# EAGLE board AIO (EAGLE 6.4)
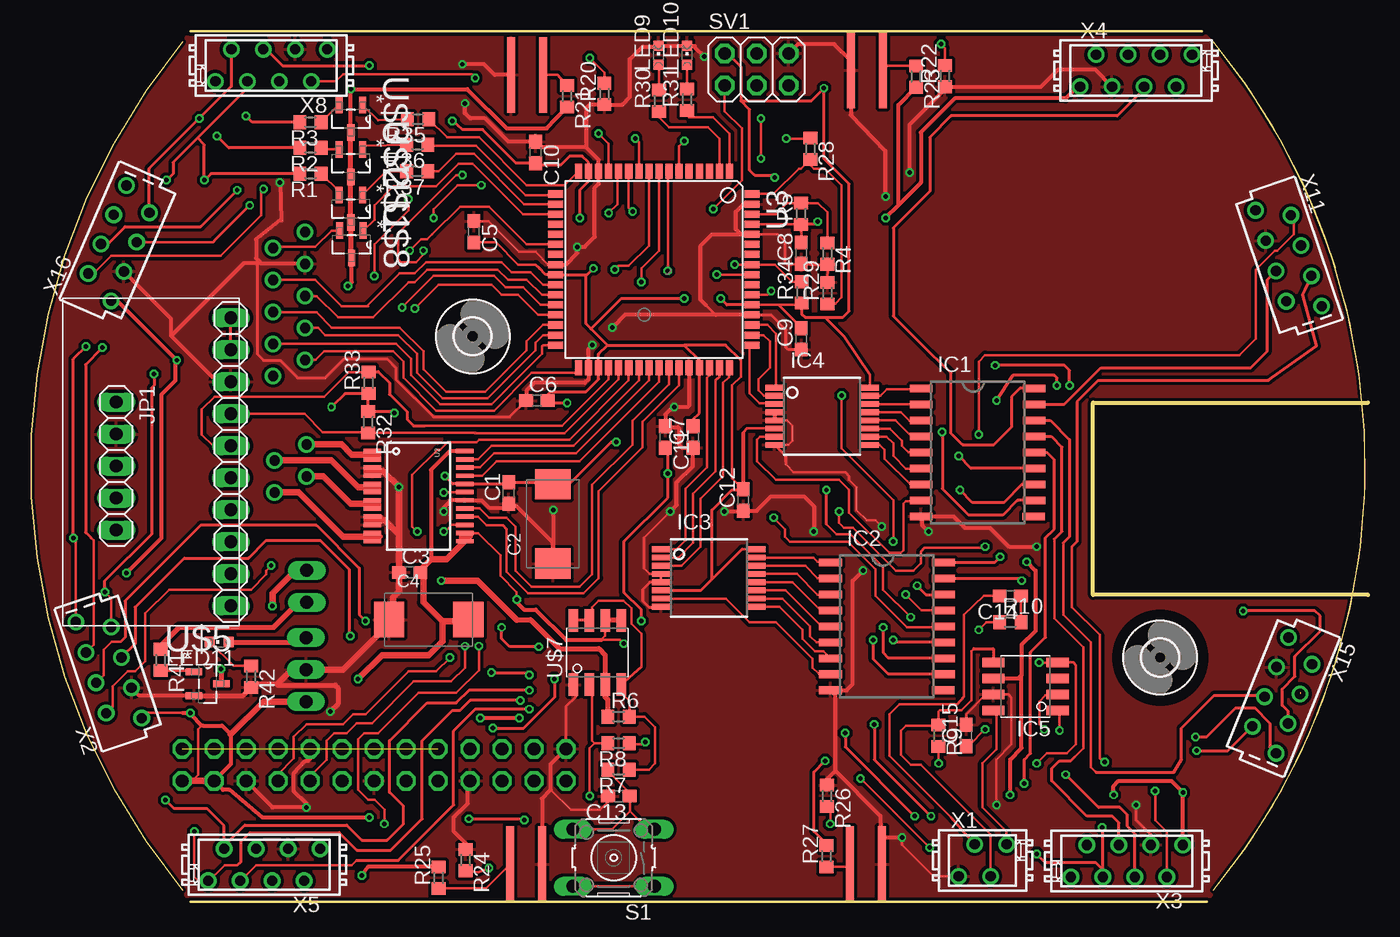
[diagram p2: board, top side]
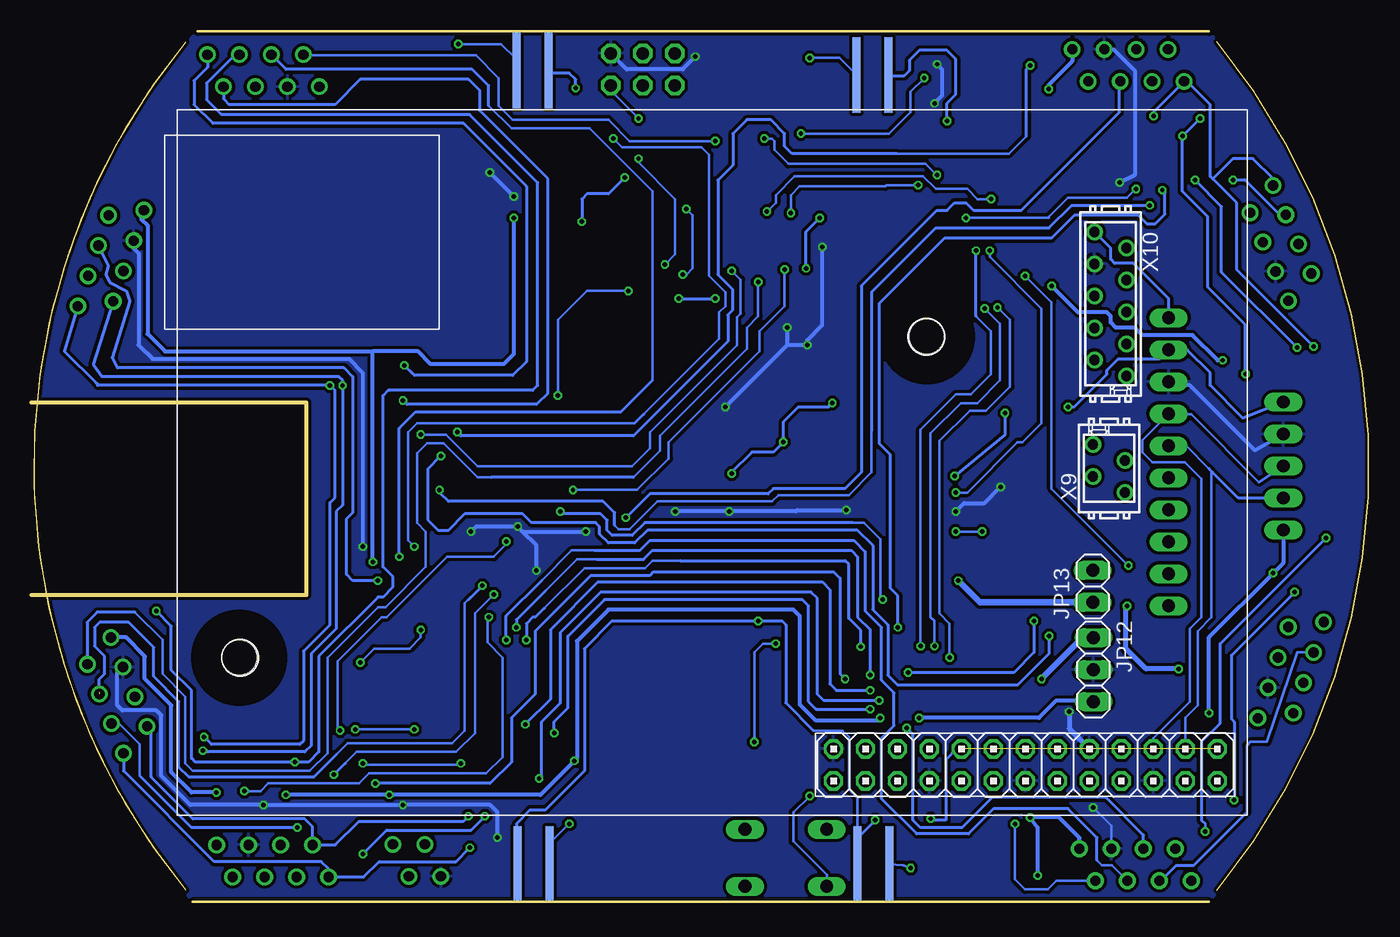
[diagram p3: board, bottom side, seen from below]

Size 106.14 x 69.1 mm. Coordinates in mm from the lower left corner, seen from the top.
Outline: 93.86,0.92 arc14 100.83,11.88
Outline: 100.83,11.88 arc43 103.56,50.33
Outline: 103.56,50.33 arc8 100.83,57.32
Outline: 100.83,57.32 arc14 93.86,68.28
Outline: 93.86,0.92 arc14 100.83,11.88
Outline: 100.83,11.88 arc43 103.56,50.33
Outline: 103.56,50.33 arc8 100.83,57.32
Outline: 100.83,57.32 arc14 93.86,68.28
Outline: 93.86,0.92 arc14 100.83,11.88
Outline: 100.83,11.88 arc43 103.56,50.33
Outline: 103.56,50.33 arc8 100.83,57.32
Outline: 100.83,57.32 arc14 93.86,68.28
Outline: 93.86,0.92 arc14 100.83,11.88
Outline: 100.83,11.88 arc43 103.56,50.33
Outline: 103.56,50.33 arc8 100.83,57.32
Outline: 100.83,57.32 arc14 93.86,68.28
Outline: 103.56,50.33 arc8 100.83,57.32
Outline: 93.86,0.92 arc22 103.56,18.87
Outline: 103.56,18.87 arc35 103.56,50.33
Outline: 103.56,50.33 arc8 100.83,57.32
Outline: 100.83,57.32 arc14 93.86,68.28
Outline: 93.86,0.92 arc22 103.56,18.87
Outline: 103.56,18.87 arc35 103.56,50.33
Outline: 103.56,50.33 arc8 100.83,57.32
Outline: 100.83,57.32 arc14 93.86,68.28
Outline: 12.02,68.28 arc79 12.02,0.92
Outline: 12.02,0.92 arc-79 12.02,68.28
Outline: 12.02,68.28 arc79 12.02,0.92
Outline: 12.02,0.92 arc-79 12.02,68.28
Outline: 12.02,68.28 arc79 12.02,0.92
Outline: 12.02,68.28 arc79 12.02,0.92
Outline: 12.02,0.92 arc-79 12.02,68.28
Outline: 12.02,68.28 arc79 12.02,0.92
Outline: 12.02,0.92 arc-79 12.02,68.28
Outline: 93.86,0.92 arc22 103.56,18.87
Outline: 103.56,18.87 arc35 103.56,50.33
Outline: 103.56,50.33 arc8 100.83,57.32
Outline: 100.83,57.32 arc14 93.86,68.28
Outline: 100.83,57.32 arc-8 103.56,50.33
Outline: 93.86,0.92 arc22 103.56,18.87
Outline: 103.56,18.87 arc35 103.56,50.33
Outline: 103.56,50.33 arc22 93.86,68.28
Outline: 93.86,0.92 arc22 103.56,18.87
Outline: 103.56,18.87 arc35 103.56,50.33
Outline: 103.56,50.33 arc22 93.86,68.28
Outline: 93.86,0.92 arc22 103.56,18.87
Outline: 103.56,18.87 arc35 103.56,50.33
Outline: 103.56,50.33 arc22 93.86,68.28
Outline: 93.86,0.92 arc22 103.56,18.87
Outline: 103.56,18.87 arc35 103.56,50.33
Outline: 103.56,50.33 arc22 93.86,68.28
Outline: 103.56,18.87 arc35 103.56,50.33
Outline: 103.56,50.33 arc22 93.86,68.28
Outline: 93.86,0.92 arc22 103.56,18.87
Outline: 103.56,18.87 arc57 93.86,68.28
Outline: 93.86,0.92 arc79 93.86,68.28
Outline: 12.63,69.1 92.93,69.1
Outline: 12.63,0 93.33,0
Outline: 106.14,39.63 84.3,39.63 84.3,24.37 106.14,24.37
Copper layers (1*2*15*16): Top 0.035mm / dielectric 0.2mm / layer 2 0.0175mm / dielectric 1.1mm / layer 15 0.0175mm / dielectric 0.2mm / Bottom 0.035mm
Design rules "DRC_critical": minimum track width 6mil, minimum drill 12mil, track to track 6mil, track to pad 6mil, pad to pad 6mil, via to via 6mil, smd to smd 0mil, copper to edge 10mil, drill to drill 10mil, minimum pad ring 10mil, minimum via ring 6mil, stop-mask expansion 2mil, vias tented up to drill 25mil, thermal gap 10mil

## Footprints (pad centres in the part's own frame; a part is rotated, then mirrored left to right if it is on the bottom)
C0603 = smd 1.1 x 1: 1 -0.85,0; 2 0.85,0
SMC_D = smd 2.4 x 2.8: + -3.15,0; - 3.15,0
SOP18 = smd 0.6 x 1.8: 1 -5.08,-4.475; 2 -3.81,-4.475; 3 -2.54,-4.475; 4 -1.27,-4.475; 5 0,-4.475; 6 1.27,-4.475; 7 2.54,-4.475; 8 3.81,-4.475; 9 5.08,-4.475; 10 5.08,4.475; 11 3.81,4.5; 12 2.54,4.5; 13 1.27,4.5; 14 0,4.5; 15 -1.27,4.5; 16 -2.54,4.5; 17 -3.81,4.5; 18 -5.08,4.5
SSOP16 = smd 0.46 x 1.43: 1 -2.275,-3.795; 2 -1.625,-3.795; 3 -0.975,-3.795; 4 -0.325,-3.795; 5 0.325,-3.795; 6 0.975,-3.795; 7 1.625,-3.795; 8 2.275,-3.795; 9 2.275,3.795; 10 1.625,3.795; 11 0.975,3.795; 12 0.325,3.795; 13 -0.325,3.795; 14 -0.975,3.795; 15 -1.625,3.795; 16 -2.275,3.795
SO08 = smd 0.72 x 1.78: 1 -1.905,-2.543; 2 -0.635,-2.543; 3 0.635,-2.543; 4 1.905,-2.543; 5 1.905,2.543; 6 0.635,2.543; 7 -0.635,2.543; 8 -1.905,2.543
1X05 = drill 1.016 long: 1 -5.08,0; 2 -2.54,0; 3 0,0; 4 2.54,0; 5 5.08,0
1X03 = drill 1.016 long: 1 -2.54,0; 2 0,0; 3 2.54,0
1X02 = drill 1.016 long: 1 -1.27,0; 2 1.27,0
CHIPLED_0603 = smd 0.8 x 0.8: A 0,-0.75; C 0,0.75
R0603 = smd 1 x 1.1: 1 -0.85,0; 2 0.85,0
B3F-10XX = drill 1.016 long: 1 -3.251,2.261; 2 3.251,2.261; 3 -3.251,-2.261; 4 3.251,-2.261
2X03 = drill 1.016 octagon: 1 -2.54,-1.27; 2 -2.54,1.27; 3 0,-1.27; 4 0,1.27; 5 2.54,-1.27; 6 2.54,1.27
SSOP24 = smd 0.348 x 1.397: 1 -3.575,-3.656; 2 -2.925,-3.656; 3 -2.275,-3.656; 4 -1.625,-3.656; 5 -0.975,-3.656; 6 -0.325,-3.656; 7 0.325,-3.656; 8 0.975,-3.656; 9 1.625,-3.656; 10 2.275,-3.656; 11 2.925,-3.656; 12 3.575,-3.656; 13 3.575,3.656; 14 2.925,3.656; 15 2.275,3.656; 16 1.625,3.656; 17 0.975,3.656; 18 0.325,3.656; 19 -0.325,3.656; 20 -0.975,3.656; 21 -1.625,3.656; 22 -2.275,3.656; 23 -2.925,3.656; 24 -3.575,3.656
TQFP-64A-64 = smd 1.194 x 0.559: 1 -7.8,6; 2 -7.8,5.2; 3 -7.8,4.4; 4 -7.8,3.6; 5 -7.8,2.8; 6 -7.8,2; 7 -7.8,1.2; 8 -7.8,0.4; 9 -7.8,-0.4; 10 -7.8,-1.2; 11 -7.8,-2; 12 -7.8,-2.8; 13 -7.8,-3.6; 14 -7.8,-4.4; 15 -7.8,-5.2; 16 -7.8,-6; 33 7.8,-6; 34 7.8,-5.2; 35 7.8,-4.4; 36 7.8,-3.6; 37 7.8,-2.8; 38 7.8,-2; 39 7.8,-1.2; 40 7.8,-0.4; 41 7.8,0.4; 42 7.8,1.2; 43 7.8,2; 44 7.8,2.8; 45 7.8,3.6; 46 7.8,4.4; 47 7.8,5.2; 48 7.8,6 | smd 0.559 x 1.194: 17 -6,-7.8; 18 -5.2,-7.8; 19 -4.4,-7.8; 20 -3.6,-7.8; 21 -2.8,-7.8; 22 -2,-7.8; 23 -1.2,-7.8; 24 -0.4,-7.8; 25 0.4,-7.8; 26 1.2,-7.8; 27 2,-7.8; 28 2.8,-7.8; 29 3.6,-7.8; 30 4.4,-7.8; 31 5.2,-7.8; 32 6,-7.8; 49 6,7.8; 50 5.2,7.8; 51 4.4,7.8; 52 3.6,7.8; 53 2.8,7.8; 54 2,7.8; 55 1.2,7.8; 56 0.4,7.8; 57 -0.4,7.8; 58 -1.2,7.8; 59 -2,7.8; 60 -2.8,7.8; 61 -3.6,7.8; 62 -4.4,7.8; 63 -5.2,7.8; 64 -6,7.8
SOT95P240X112-3N = smd 1.321 x 0.559: D 1.092,0; G -1.092,0.94; S -1.092,-0.94
2,8 = hole 2.8: 0,0
CNY70 = smd 6 x 0.635: LED_A -3,1.27; LED_C -3,-1.27 | smd 6 x 0.635 bottom: TRANS_C -3,-1.27; TRANS_E -3,1.27
GY-81 = drill 1.016 long: 3V3 8.89,-6.35; A_INT1 -3.81,-6.35; G_INT -6.35,-6.35; GND 6.35,-6.35; M_DRDY -1.27,-6.35; P_E0C -11.43,-6.35; P_XCLR -8.89,-6.35; SCL 3.81,-6.35; SDA 1.27,-6.35; VCC_IN 11.43,-6.35
RASPERRRY-PI = drill 1.016 octagon: 3V3@1 50.736,82.608; 3V3@2 50.736,62.288; 5V@1 53.276,82.608; 5V@2 53.276,80.068; GND@1 50.736,72.448; GND@2 50.736,52.128; GND@3 53.276,77.528; GND@4 53.276,67.368; GND@5 53.276,59.748; GPIO_0 50.736,80.068; GPIO_1 50.736,77.528; GPIO_4 50.736,74.988; GPIO_7 53.276,52.128; GPIO_8 53.276,54.668; GPIO_9 50.736,57.208; GPIO_10 50.736,59.748; GPIO_11 50.736,54.668; GPIO_14 53.276,74.988; GPIO_15 53.276,72.448; GPIO_17 50.736,69.908; GPIO_18 53.276,69.908; GPIO_21 50.736,67.368; GPIO_22 50.736,64.828; GPIO_23 53.276,64.828; GPIO_24 53.276,62.288; GPIO_25 53.276,57.208
MICROMATCH-4 = drill 0.813: 1 1.905,1.27; 2 0.635,-1.27; 3 -0.635,1.27; 4 -1.905,-1.27
FSIDE-8 = drill 0.813: 1 -4.445,-1.27; 2 -3.175,1.27; 3 -1.905,-1.27; 4 -0.635,1.27; 5 0.635,-1.27; 6 1.905,1.27; 7 3.175,-1.27; 8 4.445,1.27
MICROMATCH-8 = drill 0.813: 1 4.445,1.27; 2 3.175,-1.27; 3 1.905,1.27; 4 0.635,-1.27; 5 -0.635,1.27; 6 -1.905,-1.27; 7 -3.175,1.27; 8 -4.445,-1.27
MICROMATCH-10 = drill 0.813: 1 5.715,1.27; 2 4.445,-1.27; 3 3.175,1.27; 4 1.905,-1.27; 5 0.635,1.27; 6 -0.635,-1.27; 7 -1.905,1.27; 8 -3.175,-1.27; 9 -4.445,1.27; 10 -5.715,-1.27

## Placement (x,y rotation side)
C1  100nF  [C0603]  37.89,32.46 90 top
C2  10uF  [SMC_D]  41.4,30.01 90 top
C3  100nF  [C0603]  30.03,26.16 0 top
C4  10uF  [SMC_D]  31.54,22.41 0 top
C5  100nF  [C0603]  35.13,53.2 270 top
C6  100nF  [C0603]  40.13,39.8 0 top
C7  100nF  [C0603]  52.53,36.9 90 top
C8  100nF  [C0603]  61.13,51.5 90 top
C9  100nF  [C0603]  61.13,44.7 90 top
C10  100nF  [C0603]  40.03,59.5 270 top
C11  100nF  [C0603]  50.33,36.9 270 top
C12  100nF  [C0603]  56.53,31.9 90 top
C13  1uF  [C0603]  46.63,8.4 180 top
C14  100nF  [C0603]  77.73,24.3 180 top
C15  1uF  [C0603]  74.23,13.2 90 top
IC1  ULN2803ASOP18  [SOP18]  75.12,35.68 270 top
IC2  ULN2803ASOP18  [SOP18]  67.92,21.88 270 top
IC3  74HC238SSOP  [SSOP16]  53.79,25.71 270 top
IC4  74HC238SSOP  [SSOP16]  62.79,38.55 270 top
IC5  TS34119SMD  [SO08]  78.93,17.1 90 top
JP1  [1X05]  6.73,34.6 270 top
JP12  Step_Down_Conn  [1X03]  21.8,18.43 270 bottom
JP13  batt_conn  [1X02]  21.86,25.05 90 bottom
LED9  [CHIPLED_0603]  49.79,67.21 0 top
LED10  [CHIPLED_0603]  52.06,67.21 0 top
LED11  [CHIPLED_0603]  14.91,20.63 90 top
R1  [R0603]  22.15,57.82 180 top
R2  [R0603]  22.15,59.86 180 top
R3  [R0603]  22.15,61.9 180 top
R4  10K  [R0603]  63.2,51.47 270 top
R5  10K  [R0603]  61.12,54.63 90 top
R6  10k  [R0603]  46.63,14.7 0 top
R7  100k  [R0603]  46.63,10.5 180 top
R8  10k  [R0603]  46.63,12.6 180 top
R9  75k  [R0603]  72.03,13.2 270 top
R10  3k  [R0603]  77.73,22.2 0 top
R20  [R0603]  45.49,64.14 90 top
R21  [R0603]  42.53,63.96 270 top
R22  [R0603]  72.55,65.56 90 top
R23  [R0603]  70.25,65.52 270 top
R24  [R0603]  34.48,3.32 270 top
R25  [R0603]  32.34,1.92 90 top
R26  [R0603]  63.18,8.42 270 top
R27  [R0603]  63.14,3.62 90 top
R28  [R0603]  61.85,59.78 270 top
R29  [R0603]  63.21,48.33 90 top
R30  [R0603]  49.82,63.59 90 top
R31  [R0603]  52.06,63.69 90 top
R32  [R0603]  26.74,38.09 270 top
R33  [R0603]  26.76,41.21 90 top
R34  10K  [R0603]  61.16,48.38 90 top
R35  100R  [R0603]  30.7,62.14 180 top
R36  100R  [R0603]  30.64,60.12 180 top
R37  100R  [R0603]  30.64,58.01 180 top
R41  100R  [R0603]  10.26,19.21 270 top
R42  [R0603]  17.44,17.88 270 top
S1  [B3F-10XX]  46.23,3.5 180 top
SV1  PDI  [2X03]  57.59,66.09 0 top
U2  TB6612FNG  [SSOP24]  30.74,32.21 270 top
U3  ATXMEGA64D3-AU  [TQFP-64A-64]  49.43,50.2 270 top
U$1  DMN2075U  [SOT95P240X112-3N]  25.36,55.04 270 top
U$2  DMN2075U  [SOT95P240X112-3N]  25.36,58.65 270 top
U$3  DMN2075U  [SOT95P240X112-3N]  25.36,62.16 270 top
U$4  [2,8]  89.63,19.4 0 top
U$5  DMN2075U  [SOT95P240X112-3N]  13.99,17.32 0 top
U$6  [2,8]  35.03,44.9 0 top
U$7  DMC3028LSD  [SO08]  44.93,19.8 0 top
U$8  DMN2075U  [SOT95P240X112-3N]  25.41,52.2 270 top
U$21  CNY70  [CNY70]  39.36,62.65 270 top
U$22  CNY70  [CNY70]  66.33,63.02 270 top
U$23  CNY70  [CNY70]  39.29,5.99 90 top
U$24  CNY70  [CNY70]  66.26,5.99 90 top
U$25  GY-81  [GY-81]  9.48,34.94 90 top
U$26  RASPBERRY-PI  [RASPERRRY-PI]  94.57,62.88 270 bottom
X1  MICROMATCH-4  [MICROMATCH-4]  75.53,3.3 0 top
X2  [FSIDE-8]  6.13,18.4 108.5 top
X3  MICROMATCH-8  [MICROMATCH-8]  86.99,3.25 180 top
X4  MICROMATCH-8  [MICROMATCH-8]  87.72,65.99 0 top
X5  MICROMATCH-8  [MICROMATCH-8]  18.47,2.95 180 top
X8  MICROMATCH-8  [MICROMATCH-8]  19.04,66.41 180 top
X9  MICROMATCH-4  [MICROMATCH-4]  20.57,34.41 90 bottom
X10  MICROMATCH-10  [MICROMATCH-10]  20.45,47.47 270 bottom
X11  [FSIDE-8]  99.83,51.1 288.7 top
X15  [FSIDE-8]  99.33,16.4 247.9 top
X16  [FSIDE-8]  6.93,52.3 66.5 top

## Tracks (layer width: path | path; a pad name or v marks a point on that pad's centre or on a via)
+3V3  (via drill 0.36)  (1 unrouted)
  Top 0.203: C8.2 61.13,53.2 61.13,53.5 60.83,53.8 U3.61 | C5.2 36.88,52.35 38.63,50.6 40.03,50.6 40.33,50.3 | 56.43,28 IC3.16 | 56.33,43 56.33,41.7 55.63,41 55.63,33.65 C12.2 | U3.53 59.33,47.4 61.17,47.4 R34.1 | IC4.16 66.59,41.84 64.53,44.9 | 56.53,37.2 56.53,37.3 56.83,37.6 58.97,37.6 IC4.6
  Top 0.229: v34.73,6.6 39.03,6.6 v39.13,6.5 | U$25.3V3 U$25.VCC_IN | 37.83,33.2 37.83,33.25 C1.2 41.25,33.31 C2.- 42.69,33.16 46.03,36.5 v46.43,36.5 | v23.83,39.3 24.89,40.36 R33.1 26.74,40.34 R32.1 28.69,38.94 v28.83,38.8 | v32.83,33.8 33.45,33.18 U2.20 37.77,33.18 | 40.33,50.3 40.83,49.8 U3.25 44.13,49.8 | 50.33,35.7 C11.2 50.53,35.85 v50.53,34 50.53,32.1 47.03,28.6 47.03,24.6 48.43,23.2 v48.43,22.3 | 45.73,44.2 45.03,43.5 U3.35 45.03,41.5 44.03,40.5 41.23,40.5 40.98,40.25 C6.2 | 45.73,44.2 51.83,44.2 | 51.83,44.2 53.03,43 U3.45 53.03,38.8 52.53,38.3 C7.2 | v33.43,62 34.23,61.3 35.83,61.3 38.48,58.65 C10.2 40.18,58.5 42.03,58.5 42.73,59.2 43.73,59.2 44.23,58.7 U3.15 44.23,57.2 43.53,56.5 v43.53,54.3 | SV1.2 55.05,67.58 56.33,66.3 56.33,63.6 | 41.08,39.9 C6.2 | 51.83,44.2 55.13,44.2 56.33,43 | 44.43,45.5 45.73,44.2 | U3.53 55.23,47.4 v54.73,47.9 | v51.83,47.9 46.83,47.9 44.43,45.5 | 44.13,49.8 v44.63,50.3 | 44.43,45.5 44.03,45.9 44.03,49.7 44.13,49.8 | C12.2 56.48,32.7 55.63,32.7 54.03,31.1 54.03,25.6 | 54.03,25.6 56.43,28 | IC3.6 53.17,24.73 54.03,25.6 | 56.33,63.6 57.03,62.9 57.03,58.1 57.43,57.7 58.83,57.7 v59.03,57.5 | v62.43,54 62.23,53.8 61.14,53.8 R5.1 61.12,53.21 61.13,53.2 | 56.33,63.6 61.93,63.6 v62.93,64.6 62.93,59 64.93,57 64.93,46.9 64.43,46.4 63.03,46.4 | R34.1 61.16,46.67 61.43,46.4 63.03,46.4 | C9.2 61.38,45.35 59.33,47.4 | 64.53,44.9 63.03,46.4 | v42.53,39.6 41.18,39.6 C6.2
  Top 0.305: 32.95,33.68 v32.83,33.8 | 37.77,33.18 C1.2 | 41.36,33.2 C2.- | C12.2 56.53,37.2
  Bottom 0.203: U$23.TRANS_C 40.56,8.23 41.23,8.9 41.23,13.1 41.73,13.6 44.03,13.6
  Bottom 0.229: U$23.TRANS_C 40.56,5.07 v39.13,6.5 | U$26.3V3@2 32.69,12.14 33.53,11.3 33.53,6.5 34.63,6.5 v34.73,6.6 | U$24.TRANS_C 67.63,3.39 67.63,6.2 66.53,7.3 65.33,7.3 62.23,10.4 62.23,20.1 60.03,22.3 v48.43,22.3 46.53,22.3 46.23,22 46.23,15.8 44.03,13.6 | U$25.VCC_IN 15.83,47.9 18.63,50.7 20.13,50.7 20.43,51 20.43,51.89 X10.10 | v23.83,39.3 23.33,39.3 20.73,41.9 20.73,42.2 19.83,43.1 16.56,43.1 U$25.3V3 15.8,43.8 14.33,43.8 12.53,42 12.53,41 9.94,38.41 JP1.1 | v28.83,38.8 28.83,37.1 v32.83,33.8 | 38.09,64.16 U$21.TRANS_C 38.04,65.6 36.83,65.6 36.43,66 36.43,66.8 35.63,67.6 33.43,67.6 32.73,66.9 32.73,64.1 33.43,63.4 v33.43,62 | v54.73,47.9 v51.83,47.9 | v62.93,64.6 62.93,65.3 63.43,65.8 64.84,65.8 U$22.TRANS_C | v44.63,50.3 44.63,53.2 v43.53,54.3 | v50.53,34 50.53,34.1 48.93,35.7 47.23,35.7 v46.43,36.5 46.43,38.1 45.23,39.3 42.83,39.3 v42.53,39.6 | v59.03,57.5 60.33,56.2 62.03,56.2 62.43,55.8 v62.43,54
+5V  (via drill 0.36)
  Top 0.203: R27.2 62.96,4.47 | 12.03,15 9.16,15 X2.1 | 13.63,14 13.53,14 13.23,13.7 13.23,10.1 12.73,9.6
  Top 0.229: 62.96,4.47 62.96,4.77 62.13,5.6 62.13,10.3 v63.03,11.2
  Top 0.305: U$3.D v25.36,64.53 34.6,64.53 37.73,61.4 40.92,61.4 R21.2 | R25.2 26.7,2.77 v26.23,2.1 | v25.13,48.9 25.43,49.2 25.43,51.09 U$8.D | X4.8 83.05,64.72 82.13,63.8 73.33,63.8 70.63,61.1 70.63,57.1 68.83,55.3 | 70.23,64.65 R23.2 68.83,63.25 68.83,55.3 | v79.03,27 79.73,26.3 79.73,21.5 78.63,20.4 78.63,18 | v26.83,6.7 18.33,6.7 15.73,8.9 15.21,8.9 U$26.5V@2 15.83,10.93 15.83,13.3 15.13,14 13.63,14 | v67.83,54.3 68.83,55.3 | v7.53,26.1 10.33,28.9 10.33,40.3 11.43,41.4 11.43,42.9 v11.53,43 6.82,47.72 X16.1 | X3.8 v91.44,8.7 90.53,9.6 86.33,9.6 85.93,9.2 v85.93,8.5 | v35.63,14.6 v38.73,14.6 | IC5.6 78.37,17.73 78.63,18 | v77.73,8.5 77.73,11.3 78.63,12.2 78.63,18 | 12.03,15 v12.63,15 12.63,14.9 13.53,14
  Top 0.406: U$3.D U$2.D U$1.D 25.36,51.16 U$8.D
  Top 0.508: U$26.5V@2 U$26.5V@1 | JP12.3 18.42,15.89 15.83,13.3
  Bottom 0.305: X8.8 23.49,66.74 25.36,64.87 v25.36,64.53 | v12.63,15 12.63,21 v7.53,26.1 6.73,26.9 JP1.5 | X5.8 22.92,5.08 24.53,6.7 v26.83,6.7 26.23,5.9 v26.23,2.1 | v11.53,43 11.93,43 13.93,45 17.93,45 18.53,45.6 20.03,45.6 20.43,46 20.43,46.5 20.73,46.8 23.03,46.8 v25.13,48.9 | 79.03,43.7 95.53,43.7 96.93,45.1 96.93,53.7 97.42,54.19 97.21,54.41 X11.1 | v79.03,27 79.03,43.7 | v67.83,54.3 67.83,43.5 68.63,42.7 74.43,42.7 75.43,43.7 79.03,43.7 | v85.93,8.5 v77.73,8.5 65.73,8.5 v63.03,11.2 62.83,11.4 62.83,20.7 60.33,23.2 45.63,23.2 45.13,22.7 45.13,15.7 43.83,14.4 38.93,14.4 v38.73,14.6 | v91.44,8.7 93.43,8.7 95.03,10.3 95.03,15.6 97.13,17.7 97.13,19.5 98.63,21 X15.1 | JP12.3 21.91,16 24.73,16 26.13,14.6 v35.63,14.6
+7V  (via drill 0.36)
  Top 0.203: U2.14 35.45,29.29 37.23,27.5 37.23,25.9 38.53,24.6 v38.53,24 | 62.2,60.63 R28.1 61.82,60.6 v59.93,60.6 | v64.13,31 64.13,30.1 64.53,29.7 65.23,29.7 68.63,26.3 70.03,26.3 70.63,26.9 70.63,27.8 70.93,28.1 75.63,28.1 v75.73,28.2 | U$7.6 45.57,21.14 45.23,20.8 46.73,20.8 v47.03,20.5 | v48.73,12.7 48.53,12.5 47.58,12.5 R8.1
  Top 0.305: U2.24 33.22,35.78 31.73,34.3 31.73,27.2 | 34.13,28.8 34.13,29.02 U2.14 | v38.53,24 38.53,23.8 39.13,23.2 40.03,23.2 42.43,20.8 45.23,20.8
  Top 0.406: U2.13 34.47,28.64 34.83,29 34.33,29 34.13,28.8 | LED11.A 21.46,20.63 JP12.1 | U$7.5 U$7.6
  Top 0.508: 32.63,22.27 32.63,20.7 31.53,19.6 27.83,19.6 v25.93,17.7 | U2.13 32.97,27.2 31.73,27.2 31.08,26.55 C3.2 31.13,26.11 31.13,23.77 32.63,22.27 | 32.63,22.27 34.55,22.27 C4.- 35.23,22.4 35.23,21.9
  Bottom 0.203: v75.73,28.2 76.23,28.7 76.23,37.3 75.53,38 58.23,38 | v38.53,24 38.73,24.2 38.73,28.8 40.03,30.1 40.93,30.1 | 57.53,38.7 51.53,44.7 51.53,46.8 51.03,47.3 51.03,48.4 52.33,49.7 52.33,59.3 52.93,59.9 59.23,59.9 v59.93,60.6 | v47.03,20.5 48.03,20.5 48.73,19.8 v48.73,12.7
  Bottom 0.229: 40.93,30.1 57.43,30.1 58.43,29.1 60.03,29.1 60.43,29.5 60.43,30.3 60.93,30.8 63.93,30.8 v64.13,31 | 57.53,38.7 58.23,38
  Bottom 0.508: v25.93,17.7 22.6,21.03 21.86,21.03 JP12.1
ADISTANCE_0  (via drill 0.36)
  Top 0.203: U3.6 51.43,60 v51.83,60.4
  Bottom 0.203: X4.7 84.49,67.2 70.83,67.2 69.03,65.4 69.03,63.2 67.93,62.1 60.33,62.1 58.63,60.4 v51.83,60.4
ADISTANCE_1  (via drill 0.36)
  Top 0.203: U3.7 50.53,57.9 v50.53,50.1 | X11.2 100.02,54.63 100.23,54.85 100.23,53 98.93,51.7 98.73,51.7 97.23,50.2 97.23,44.7 95.93,43.4 75.73,43.4 75.23,42.9 v75.23,37.1
  Bottom 0.203: v50.53,50.1 49.83,49.4 49.83,46.7 50.13,46.4 50.13,44.2 57.03,37.3 57.03,36 58.43,34.6 70.73,34.6 73.23,37.1 v75.23,37.1
ADISTANCE_2  (via drill 0.36)
  Top 0.203: U3.8 49.83,51.7 48.43,50.3 v48.43,49.2
  Bottom 0.203: v48.43,49.2 48.43,46.5 49.33,45.6 49.33,43.9 56.23,37 56.23,35.8 58.33,33.7 | 69.63,33.7 70.73,33.7 73.43,36.4 74.73,36.4 75.53,35.6 75.53,30.1 74.83,29.4 74.83,26.6 78.03,23.4 78.63,23.4 82.63,19.4 82.63,11.8 84.03,10.4 93.33,10.4 93.93,11 93.93,16.3 95.73,18.1 95.73,20.8 97.93,23
  Bottom 0.229: 58.33,33.7 69.63,33.7 | 97.93,23 100.93,23 101.73,22.2 101.73,18.89 X15.2
ADISTANCE_3  (via drill 0.36)
  Top 0.203: X3.7 90.17,5.57 89.23,6.5 v89.23,8.8 | U3.9 49.03,52.1 47.43,50.5 46.63,50.5 v46.33,50.2 | 63.13,30 63.93,29.2 65.03,29.2 67.63,26.6 67.63,24.8 v69.83,22.6
  Top 0.229: 63.13,30 v63.13,32.7
  Bottom 0.203: v46.33,50.2 46.33,47.3 48.33,45.3 48.33,43.7 55.53,36.5 55.53,35.2 58.03,32.7 v63.13,32.7 | v89.23,8.8 87.93,8.8 87.33,9.4 80.13,9.4 79.33,10.2 70.03,10.2 68.73,11.5 68.73,19.4 69.93,20.6 69.93,22.5 v69.83,22.6
ADISTANCE_4  (via drill 0.36)
  Top 0.203: v28.03,6.2 28.03,7.3 27.23,8.1 26.73,8.1 25.93,8.9 25.93,12.9 26.43,13.4 27.53,13.4 30.73,16.6 33.73,16.6 35.53,18.4 v35.53,20.3 | U3.10 48.23,60.3 v47.93,60.6 | v34.23,57.7 33.73,57.7 29.13,53.1 29.13,51 29.33,50.8 30.53,50.8 31.13,51.4 v31.13,51.7
  Bottom 0.203: v35.53,20.3 35.53,37.5 32.73,40.3 31.53,40.3 29.93,41.9 29.93,45.3 31.13,46.5 | v47.93,60.6 47.33,60.6 47.13,60.4 47.13,59.7 46.03,58.6 35.13,58.6 v34.23,57.7 | X5.7 24.75,1.68 25.43,1 27.23,1 28.03,1.8 v28.03,6.2
  Bottom 0.229: 31.13,46.5 v31.13,51.7
ADISTANCE_5  (via drill 0.36)
  Top 0.203: v27.23,49.7 27.23,52.2 29.93,54.9 v29.93,55.8 | v19.03,26.7 18.63,26.3 18.63,26 17.43,24.8 10.93,24.8 9.03,22.9 9.03,19.1 8.23,18.3 7.63,18.3 6.43,17.1 6.43,15.48 X2.2 | U3.11 47.43,55.1 v47.73,54.8
  Bottom 0.203: v19.03,26.7 25.13,32.8 25.13,47.6 v27.23,49.7 | v29.93,55.8 31.03,55.8 31.83,56.6 34.33,56.6 35.33,57.6 45.53,57.6 47.03,56.1 47.03,55.5 v47.73,54.8
ADISTANCE_6  (via drill 0.36)
  Top 0.203: U3.12 46.53,58.1 46.53,55.4 v45.83,54.7 | v18.43,56.6 18.23,56.4 18.23,54.5 15.03,51.3 6.33,51.3 4.93,49.89 X16.2 | v35.73,56.9 33.83,56.9 31.93,55 v31.93,54.3
  Bottom 0.203: v31.93,54.3 25.33,54.3 25.33,54.4 23.83,55.9 19.13,55.9 v18.43,56.6 | v45.83,54.7 45.83,56.1 45.13,56.8 38.33,56.8 38.23,56.9 v35.73,56.9
ADISTANCE_7  (via drill 0.36)
  Top 0.203: X8.7 24.17,65.14 24.73,65.7 34.93,65.7 v35.23,65.4 | U3.13 45.83,60.2 v45.03,61
  Bottom 0.203: v35.23,65.4 36.33,64.3 36.33,62.7 38.03,61 v45.03,61
AUDIO_DISABLE  (via drill 0.36)
  Top 0.203: U3.54 58.43,48.2 v58.73,48.5 | v64.33,40.2 64.33,36 68.43,31.9 v68.43,28.6 | v81.63,13.6 81.63,15.04 IC5.1
  Bottom 0.203: v58.73,48.5 62.03,48.5 64.33,46.2 v64.33,40.2 | v68.43,28.6 68.43,28.4 69.43,27.4 73.13,27.4 77.93,22.6 78.33,22.6 81.83,19.1 81.83,13.8 v81.63,13.6
AUDIO_IN
  Top 0.203: C14.2 75.63,24.3 74.03,22.8 74.03,16.3 73.53,15.7 68.93,15.7 68.13,14.9 68.13,11.6 73,6.74 X1.3
BATT_GND  (via drill 0.36)
  Top 0.406: U$5.D 15.09,18.45 v15.03,18.5
  Top 0.508: v19.13,23.5 19.13,24.5 20.93,26.3 21.84,26.3 JP13.2
  Bottom 0.406: v15.03,18.5 17.63,18.5 19.23,20.1 19.23,23.4 v19.13,23.5
BATT_U  (via drill 0.36)
  Top 0.406: R41.1 10.26,20.33 11.73,21.8 19.23,21.8 21.23,23.8 21.84,23.8 JP13.1 | 38.53,22.4 39.63,22.4 41.93,20.1 45.07,20.1 45.57,19.6 U$7.3 45.53,17.22 45.53,16.3 45.78,16.05 R6.1
  Top 0.508: v32.53,25.5 35.43,25.5 38.53,22.4
  Bottom 0.508: JP13.1 30.81,23.78 v32.53,25.5
BATT_VOLTAGE
  Top 0.203: U3.64 58.93,56.2 60.93,58.2 61.12,58.2 R28.2 61.85,58.48 62.13,58.2 63.03,58.2 64.33,56.9 64.33,48 63.83,47.5 63.23,47.5 R29.1
BATT_WARN_0
  Top 0.203: R31.1 52.06,62.47 52.23,62.3 54.13,62.3 55.43,61 U3.1
BATT_WARN_1
  Top 0.203: R30.1 49.82,62.31 50.63,61.5 53.73,61.5 54.63,60.6 U3.2
COLOR_DIODE_1
  Top 0.203: X10.4 22.77,45.56 23.33,45 29.13,45 30.63,43.5 30.63,42 32.63,40 36.23,40 40.03,43.8 40.03,44.4 40.63,45 U3.31
COLOR_DIODE_2
  Top 0.203: X10.3 28.94,44.29 30.13,43.1 30.13,41.8 32.43,39.5 36.53,39.5 40.53,43.5 40.53,44.1 40.63,44.2 U3.32
COLOR_FREQ_OUT
  Top 0.203: X10.7 19.21,49.4 22.53,49.4 24.63,47.3 26.63,47.3 | U3.26 40.63,49 39.63,50 38.13,50 37.33,50.8 31.33,50.8 30.43,49.9 29.23,49.9 26.63,47.3 | 26.63,47.3 26.73,47.3
COLOR_SENSOR_1
  Top 0.203: X10.2 22.56,43.02 23.23,43.7 28.73,43.7 29.53,42.9 29.53,41.6 32.13,39 36.73,39 39.73,42 43.23,42 43.43,42.2 U3.33
COLOR_SENSOR_2
  Top 0.203: X10.6 22.63,48.1 24.33,46.4 27.13,46.4 29.93,49.2 30.43,49.2 31.43,50.2 37.03,50.2 37.83,49.4 39.33,49.4 40.53,48.2 U3.27
COLOR_SENSOR_3
  Top 0.203: X10.5 19.22,46.8 22.63,46.8 23.83,45.6 29.23,45.6 31.13,43.7 31.13,42.3 32.93,40.5 36.03,40.5 39.33,43.8 39.33,44.5 40.63,45.8 U3.30
COLOR_SENSOR_PWM_LED
  Top 0.203: U$8.G 27.23,54.17 27.23,55.3 28.73,56.8 32.13,56.8 33.93,58.6 35.03,58.6 39.03,54.6 U3.19
ENCODER_L1  (via drill 0.36)
  Top 0.203: R20.2 45.49,65.84 v44.33,67
  Bottom 0.203: v44.33,67 41.98,67 U$21.TRANS_E
ENCODER_L2  (via drill 0.36)
  Top 0.203: R22.2 72.55,67.78 v72.23,68.1
  Bottom 0.203: v72.23,68.1 68.83,68.1 67.73,67 67.73,66.15 U$22.TRANS_E
ENCODER_R1  (via drill 0.36)
  Top 0.203: R24.2 35.5,2.37 v36.33,2.7
  Bottom 0.203: v36.33,2.7 36.93,2.9 U$23.TRANS_E
ENCODER_R2  (via drill 0.36)
  Top 0.203: v63.43,6.2 63.43,7.32 R26.2
  Bottom 0.203: 65.03,4 65.03,3.33 U$24.TRANS_E 64.98,4.65 v63.43,6.2
GND  (via drill 0.36)
  Top 0.203: U3.60 59.23,53 59.83,52.4 59.83,50.8 60.08,50.55 C8.1 | C13.2 45.78,7.95 45.13,7.3 42.83,7.3 41.23,8.9 | C5.1 36.28,54.05 38.73,51.6 40.03,51.6 41.03,50.6 U3.24 | R29.2 63.25,50.57 R4.2 | IC3.5 IC3.4 49.1,26.04 48.63,26.5 48.63,28.9 v50.73,31 | v67.53,29.8 67.03,30.3 66.33,30.3 65.53,31.1 65.53,32.9 64.93,33.5 64.93,33.8 64.63,34.1 60.53,34.1 59.91,34.72 59.91,34.96 | v69.13,5.1 69.13,4.52 71.63,2.03 X1.4 | IC4.5 60.01,38.22 60.43,37.8 60.43,36.6 60.13,36.3 59.02,36.3 IC4.8 | C15.2 74.23,14.9 75.8,16.46 IC5.7 77.57,16.46 77.83,16.2 77.83,12.5 76.63,11.3 v76.63,7.7
  Top 0.229: U$26.GND@2 42.45,15.51 43.23,16.3 43.23,17.25 U$7.1 | 17.93,50.7 17.93,43.5 18.43,43 19.73,43 21.13,41.6 23.33,41.6 24.83,43.1 28.23,43.1 28.93,42.4 28.93,41.5 31.93,38.5 37.98,38.5 C6.1 | C8.1 63.13,50.55 R4.2 | IC3.5 49.12,25.39 48.53,24.8 48.53,23.9 49.03,23.4 49.96,23.4 IC3.8 | U3.52 58.73,46.6 59.93,45.4 59.93,44 60.08,43.85 C9.1 | 59.91,34.96 59.91,35.36 IC4.8 | X3.6 88.9,5.33 87.73,6.5 v87.73,7.7
  Top 0.254: 54.33,46.6 53.53,47.4
  Top 0.305: 27.75,30.58 U2.9 26.82,30.58 26.53,30.3 26.73,30.3 | 27.63,30.3 26.73,30.3 | 26.73,30.3 26.53,30.1 27.25,30.1 | 27.63,30.1 27.25,30.1 | 27.25,30.1 U2.10 | 11.08,44.95 14.73,41.3 U$25.GND | v19.73,57.1 19.83,54.1 19.73,54.1 17.83,52.6 17.83,51.1 18.23,50.7 | U$26.GND@3 19.15,7.5 v21.83,7.5 21.83,7.8 20.83,8.8 20.83,10.2 21.73,11.2 21.93,11.2 22.13,11.4 U$26.GND@1 | U$23.LED_C 40.53,3.02 40.53,8.2 41.23,8.9 41.23,10.93 U$26.GND@2 | R24.1 34.48,4.65 33.53,5.6 33.53,6.7 34.63,7.8 34.63,9.41 U$26.GND@5 | U$24.LED_C 67.43,3.39 67.43,5.1 67.63,5.1 | v69.13,5.1 67.63,5.1 | 18.23,50.7 21.67,50.7 X10.8 | 18.23,50.7 17.93,50.7 16.83,50.7 11.08,44.95 | v32.73,31 32.73,31.3 33.32,31.89 U2.18 35.75,31.89 36.33,31.3 37.58,31.3 C1.1 38.1,31.4 38.53,31.4 41.4,28.53 C2.+ 41.43,30.09 v41.43,31.1 | U3.44 52.23,39.4 52.13,39.3 v51.03,39.3 50.93,39.3 50.33,38.7 C11.1 50.38,37.7 51.33,37.7 51.43,37.6 51.43,36.3 51.68,36.05 C7.1 52.53,34.6 51.28,33.35 51.23,33.35 51.23,31.5 v50.73,31 | 44.03,59.9 45.03,58.9 U3.14 45.03,57 44.73,56.7 44.73,52.8 43.93,52 v43.33,52 43.33,51.5 42.43,50.6 U3.24 | 44.03,59.9 40.48,59.9 C10.1 37.88,60.35 36.03,62.2 34.83,62.2 34.43,62.6 v34.43,63.4 | v44.53,44.2 44.23,43.9 U3.34 44.23,41.5 43.93,41.2 39.93,41.2 39.33,40.6 39.33,39.85 C6.1 | 63.53,16.71 IC2.9 | U$21.LED_C 36.78,65.65 35.93,66.5 v34.23,66.5 | U3.52 54.33,46.6 47.13,46.6 v46.13,45.6 | v53.43,67.1 52.67,67.86 52.67,67.96 LED10.C LED9.C 49.73,67.9 48.53,67.9 47.53,66.9 47.53,63.9 46.92,63.29 R20.1 44.32,63.29 44.03,63 44.03,59.9 | IC2.9 64.73,16.8 65.23,17.3 65.23,25.5 v66.03,26.3
  Top 0.305: SV1.6 60.87,68.1 63.73,68.1 65.06,66.77 U$22.LED_C 65.06,62.47 67.83,59.6 v67.83,56 | X4.6 84.44,66.1 81.53,66.1 80.14,64.71 R22.1 72.55,64.52 69.73,61.7 v69.73,57.9 | 53.53,47.4 53.13,47.8 53.13,52.1 54.03,53 U3.60 56.33,53 55.93,53.4 55.93,54.8 56.53,55.4 U3.63 | v71.23,29.4 70.73,29.9 70.73,30.52 IC1.9 73.23,30.6 74.13,29.7 76.13,29.7 77.63,28.2 v79.83,28.2 | 67.63,5.1 67.43,5.3 67.43,6.8 63.83,10.4 | 63.83,10.4 63.83,16.41 IC2.9 | R26.1 63.18,9.75 63.83,10.4 | U2.4 26.53,34 | 26.53,34 27.56,34.15 U2.3 | 26.53,34 26.53,34.3 27.13,34.2 | v55.03,31 56.48,31 C12.1 57.58,31.05 58.73,32.2 61.33,32.2 62.13,31.4 v62.13,29.4 | IC4.4 IC4.5 | 19.53,17.3 17.71,17.3 | U$5.S 8.56,16.38 X2.3 | 11.08,44.95 11.08,46.3 X16.3
  Top 0.406: U$25.GND | 19.53,17.3 19.53,17.2 24.13,17.2 24.33,17 24.33,15.7 v23.73,15.1 | U$5.S 16.79,16.38 R42.2 17.71,17.3
  Top 0.508: 29.18,29.15 C3.1 29.18,24.65 28.73,24.2 28.73,22.55 C4.+ 28.59,22.26 24.76,18.43 JP12.2 21.73,18.5 20.73,18.5 19.53,17.3 | 29.18,29.15 28.03,30.3 27.63,30.3 | 29.18,29.15 v29.18,32.95 27.93,34.2 27.61,34.2 27.56,34.15
  Bottom 0.203: X5.6 20.38,6.04 v21.83,7.5
  Bottom 0.305: v32.73,31 32.08,31.65 30.48,31.65 v29.18,32.95 | X8.6 20.21,67.68 18.53,66 18.53,57.7 v19.73,57.1 | 46.13,44.2 v44.53,44.2 44.53,44.6 43.33,45.8 v43.33,52 | 46.13,44.2 v51.03,39.3 | v34.23,66.5 33.83,66.1 33.83,64 v34.43,63.4 | v53.43,67.1 54.43,66.1 58.87,66.1 SV1.6 | v41.43,31.1 45.33,31.1 45.43,31 v50.73,31 v55.03,31 | v46.13,45.6 46.13,44.2 | v79.83,28.2 79.83,42 80.93,43.1 96.53,43.1 97.63,44.2 97.63,51.5 98.3,52.16 98.3,52.22 X11.3 | v67.53,29.8 67.53,29.6 | 67.13,29.4 v62.13,29.4 | JP1.2 9,35.87 14.13,41 15.54,41 U$25.GND | v69.73,57.9 v67.83,56 | 67.13,29.4 v67.53,29.8 | v67.53,29.8 70.83,29.8 v71.23,29.4 | v66.03,26.3 66.03,28.3 67.13,29.4 | v69.13,5.1 69.13,7.1 69.73,7.7 v76.63,7.7 v87.73,7.7 93.53,7.7 95.83,10 95.83,14.8 96.23,15.2 98.93,15.2 99.33,15.6 99.33,18.18 X15.3
  Bottom 0.406: v23.73,15.1 23.73,13.75 U$26.GND@1
  pour Bottom (isolate 0.254): 12.53,0.1 8.13,6.3 5.03,11.8 2.23,19 0.73,25.4 -0.07,31.8 0.03,38.9 1.13,46.1 3.53,54 6.03,59.2 8.83,64.2 11.93,68.2 12.63,69.1 92.93,69.1 94.23,67.8 96.43,64.8 98.93,60.9 101.13,56.7 103.53,50.7 105.03,44.4 105.83,38.6 105.93,32.9 105.43,27.4 104.53,21.9 101.83,13.9 99.13,8.6 95.83,3.4 93.33,0 12.63,0
  pour Top (isolate 0.254): 12.53,0.1 8.13,6.3 5.03,11.8 2.23,19 0.73,25.4 -0.07,31.8 0.03,38.9 1.13,46.1 3.53,54 6.03,59.2 8.83,64.2 11.93,68.2 12.63,69.1 92.93,69.1 94.23,67.8 96.43,64.8 98.93,60.9 101.13,56.7 103.53,50.7 105.03,44.4 105.83,38.6 105.93,32.9 105.43,27.4 104.53,21.9 101.83,13.9 99.13,8.6 95.83,3.4 93.33,0 12.63,0
IR_LED_K0
  Top 0.203: IC3.15 62.1,27.33 62.43,27 63.41,27 IC2.1
IR_LED_K0_OUT  (via drill 0.36)
  Top 0.229: IC2.18 76.49,26.96 v76.93,27.4
  Bottom 0.203: 56.83,41.4 56.83,56.4 61.83,61.4 68.03,61.4 69.83,63.2
  Bottom 0.229: v76.93,27.4 76.93,37.6 75.63,38.9 59.33,38.9 56.83,41.4 | 69.83,63.2 69.83,64.8 71.13,66.1 85.93,66.1 X4.5
IR_LED_K1
  Top 0.203: IC3.14 61.45,26.68 62.43,25.7 63.44,25.7 IC2.2
IR_LED_K1_OUT  (via drill 0.36)
  Top 0.229: IC2.17 78.44,25.69 v78.63,25.5
  Bottom 0.229: v78.63,25.5 80.63,25.5 81.13,26 81.13,30.4 80.63,30.9 80.63,41.7 81.33,42.4 99.33,42.4 99.73,43.2 98.33,47.7 98.63,48.5 99.93,49.2 100.23,49.8 100.03,50.5 100.23,50.9 X11.4
IR_LED_K2_OUT  (via drill 0.36)  (1 unrouted)
  Top 0.229: v70.33,25.1 71.03,24.4 72.4,24.4 IC2.16
  Bottom 0.203: 81.93,11.7 81.03,12.6 72.73,12.6 71.73,13.6 71.73,23.7 71.28,24.15
  Bottom 0.229: 100.75,16.64 100.75,17.68 100.33,18.1 100.33,19.5 101.13,20.3 101.13,21.8 100.73,22.2 98.43,22.2 96.43,20.2 96.43,17.9 94.43,15.9 94.43,10.7 93.63,9.9 83.73,9.9 81.93,11.7 | 71.43,24 71.28,24.15 v70.33,25.1
IR_LED_K3_OUT  (via drill 0.36)
  Top 0.203: IC2.15 70.68,23.15 v69.43,24.4
  Top 0.229: X3.5 87.63,5.41 87.03,6 87.03,6.9 86.43,7.5 84.73,7.5 v82.13,10.1
  Bottom 0.203: v69.43,24.4 70.93,22.9 70.93,13.4 72.43,11.9 80.33,11.9 81.23,11
  Bottom 0.229: 81.23,11 v82.13,10.1
IR_LED_K4_OUT  (via drill 0.36)
  Top 0.229: IC2.13 68.63,20.6 v68.43,20.8
  Bottom 0.203: 61.43,27.9 63.23,27.9 65.63,25.5 | X5.5 20.33,2.9 21.13,2.9 21.53,3.3
  Bottom 0.229: 21.53,3.3 21.53,5.1 23.83,7.4 29.73,7.4 31.73,5.4 35.83,5.4 38.63,8.2 38.63,13 37.63,14 37.63,16.6 38.63,17.6 38.63,21.8 39.93,23.1 39.93,27.8 40.83,28.7 57.03,28.7 57.83,27.9 61.43,27.9 | v68.43,20.8 68.43,22.7 65.63,25.5
IR_LED_K5_OUT  (via drill 0.36)
  Top 0.203: 7.09,20.65 6.39,20.65 5.73,20 5.73,18 X2.4
  Top 0.229: v26.53,22.3 26.03,22.8 26.03,26.5 22.63,29.9 13.43,29.9 7.43,23.9 7.43,21 7.09,20.65 | v36.53,18.2 39.33,18.2 v39.53,18 | v67.63,21.8 67.63,19.8 68.03,19.4 72.36,19.4 IC2.12
  Bottom 0.203: 61.23,27.2 62.83,27.2 65.33,24.7
  Bottom 0.229: v26.53,22.3 26.53,19.8 28.13,18.2 v36.53,18.2 | v39.53,18 39.53,21.6 40.53,22.6 40.53,27.4 41.03,27.9 56.83,27.9 57.53,27.2 61.23,27.2 | 65.33,24.7 67.63,22.4 v67.63,21.8
IR_LED_K6_OUT  (via drill 0.36)
  Top 0.229: v16.33,56.5 13.43,53.6 7.43,53.6 6.06,52.22 X16.4 | v40.28,20.26 37.98,20.26 37.33,20.9 v37.33,21.8 | v66.83,20.8 66.83,19.3 68.03,18.1 72.39,18.1 IC2.11
  Bottom 0.203: 54.63,27.1 56.83,27.1 57.43,26.5 62.23,26.5 65.43,23.3
  Bottom 0.229: v16.33,56.5 16.13,56.3 16.13,54.6 16.93,53.8 17.53,53.8 18.23,54.5 23.33,54.5 25.13,52.7 33.63,52.7 38.83,47.5 38.83,36.4 37.93,35.5 37.93,24.9 37.33,24.3 v37.33,21.8 | 54.63,27.1 41.53,27.1 41.23,26.8 41.23,22.5 40.28,21.55 v40.28,20.26 | 65.43,23.3 66.13,22.6 66.33,22.6 66.83,22.1 v66.83,20.8
IR_LED_K7_OUT  (via drill 0.36)
  Top 0.203: v58.93,30.5 59.83,29.6 59.83,29 60.23,28.6 64.83,28.6 67.03,26.4 67.03,24.3 69.53,21.8 72.34,21.8 IC2.14
  Bottom 0.229: X8.5 19.73,65.08 19.73,62.7 27.53,54.9 31.33,54.9 31.93,55.5 32.83,55.5 33.43,54.9 34.23,54.9 40.23,48.9 40.23,34.1 41.53,32.8 47.23,32.8 47.63,32.4 57.03,32.4 v58.93,30.5
IR_LED_MK0
  Top 0.203: IC3.1 51.22,27.99 51.93,28.7 51.93,32.8 53.63,34.5 53.63,41.6 53.83,41.8 U3.46
IR_LED_MK1
  Top 0.203: IC3.2 51.37,27.33 52.53,28.5 52.53,32.4 54.33,34.2 54.33,41.4 54.63,41.7 U3.47
IR_LED_MK2
  Top 0.203: U3.48 55.39,42.35 55.39,41.65 54.93,41.2 54.93,33.8 53.13,32 53.13,28.2 51.63,26.7 50.01,26.7 IC3.3
LED_A0
  Top 0.203: U3.16 42.33,56.9 39.33,56.9 35.53,60.7 32.99,60.7 R35.1
LED_A0_OUT  (via drill 0.36)
  Top 0.203: v71.33,4.3 v65.83,9.8 | 16.63,3.2 16.33,2.9 15.33,2.9 14.11,1.68 X5.1 13.25,1.68 12.93,2 v12.93,5.6 | X2.8 3.52,28.71 v3.33,28.9
  Top 0.229: R3.2 17.53,61.9 v17.03,62.4 | v76.53,42.6 82.03,42.6 82.43,42.2 v82.43,41 | X15.8 98.33,12.31 98.33,14.2 97.13,15.4 95.63,15.4 93.33,13.1 v92.43,13.1 | v4.33,44.1 3.33,43.1 v3.33,28.9 | v38.83,16 34.83,16 34.03,15.2 33.43,15.2 31.03,12.8 31.03,6.6 28.53,4.1 25.83,4.1 24.43,5.5 17.33,5.5 16.63,4.8 16.63,3.2
  Bottom 0.203: v12.93,5.6 12.93,6.2 13.23,6.5
  Bottom 0.229: 12.33,57.4 10.43,55.5 10.43,50.2 v4.33,44.1 | 12.33,57.4 12.53,57.6 12.53,63.3 14.37,65.14 X8.1 17.03,62.7 v17.03,62.4 | 13.23,6.5 13.23,12.7 11.73,14.2 11.73,20.5 v3.33,28.9 | X4.1 92.17,66.27 93.23,65.2 93.23,63.3 91.73,61.8 71.83,61.8 66.83,56.8 66.83,42.9 67.93,41.8 75.73,41.8 v76.53,42.6 75.83,41.9 | 12.33,57.4 10.73,59 9.13,59 7.54,57.41 X16.8 | 101.03,41.2 100.89,41.1 | 100.89,41.1 103.53,43.7 X11.8 | 100.89,41.1 100.89,41 v82.43,41 82.03,40.6 82.03,32.1 82.43,31.7 82.43,22 84.53,19.9 84.53,12.8 84.83,12.5 91.83,12.5 v92.43,13.1 | v38.83,16 43.23,16 43.73,16.5 43.73,24.1 44.23,24.6 60.93,24.6 64.13,21.4 64.13,15.8 65.63,14.3 65.63,10 v65.83,9.8 | X15.8 98.84,10.4 91.63,3.2 83.13,3.2 82.55,2.61 X3.1 79.75,1.98 78.53,3.2 72.43,3.2 v71.33,4.3
LED_A1
  Top 0.203: U3.17 41.53,56.1 39.23,56.1 35.31,60.02 31.59,60.02 R36.1
LED_A1_OUT  (via drill 0.36)
  Top 0.203: X2.7 6.33,24.1 v5.83,24.6
  Top 0.229: X8.2 15.87,64.73 v13.33,62.2 9.37,58.23 X16.7 | R2.2 15.67,59.86 v14.73,60.8 | v9.73,41.9 9.73,41 9.53,40.8 9.53,29.2 5.83,25.5 v5.83,24.6 | v81.43,41 81.43,41.6 81.23,41.8 77.93,41.8 v76.63,39.8 | v92.53,12 95.03,12 X15.7 | v39.53,16.8 34.73,16.8 33.73,15.8 31.43,15.8 28.43,12.8 28.43,8.7 29.53,7.6 29.53,6.2 28.23,4.9 26.23,4.9 25.03,6.1 16.93,6.1 15.3,4.46 X5.2 15.3,6.03 13.93,7.4 11.33,7.4 v10.63,8.1 | v66.93,14.1 66.93,11.3 v71.43,6.8
  Bottom 0.229: v9.73,41.9 9.73,45.8 12.73,48.8 12.73,54.4 14.73,56.4 v14.73,60.8 v13.33,62.2 | v10.63,8.1 10.63,14.3 10.83,14.5 10.83,19.6 v5.83,24.6 | v66.93,14.1 64.93,16.1 64.93,21.6 61.13,25.4 43.33,25.4 42.73,24.8 42.73,17.3 42.23,16.8 v39.53,16.8 | X4.2 90.9,63.77 90.43,63.3 82.03,63.3 80.03,65.3 71.43,65.3 70.53,64.4 70.53,62.8 65.13,57.4 65.13,40.4 66.03,39.5 76.33,39.5 v76.63,39.8 | X11.7 101.23,42.7 100.53,41.7 81.73,41.7 81.43,41.4 v81.43,41 81.43,31.5 81.93,31 81.93,21.7 83.93,19.7 83.93,12.4 84.43,11.9 92.13,11.9 v92.53,12 | X15.7 arc90 96.63,13.61 96.63,9.9 93.33,6.6 84.43,6.6 83.82,5.99 X3.2 82.01,4.52 80.13,6.4 71.83,6.4 v71.43,6.8
LED_A2
  Top 0.203: 31.43,57.95 R37.1 32.34,58.01 33.73,59.4 35.13,59.4 39.13,55.4 U3.18
LED_A2_OUT  (via drill 0.36)
  Top 0.203: 82.63,28.2 82.63,23.4 84.83,21.2 84.83,11.4 v85.23,11.1 | X5.3 16.61,1.68 17.83,2.9 25.43,2.9 25.83,3.3 | X2.6 4.93,20.41 4.93,28.7 4.33,29.3
  Top 0.229: X8.3 17.14,64.61 13.18,60.65 | 13.18,60.65 13.73,60.1 v13.73,57.3 14.25,57.82 R1.2 | 25.83,3.3 29.13,3.3 33.53,7.7 33.53,13.6 35.23,15.3 v39.53,15.3 | v64.63,13.4 64.63,12.3 v70.13,6.8 | 85.09,2.54 85.09,5.75 v85.03,5.9 | v96.23,23.1 101.93,23.1 102.33,22.7 102.33,21.5 100.33,19.5 100.33,17.9 99.33,16.9 99.33,15.6 99.79,15.14 X15.6 | 4.73,28.9 4.33,29.3 4.3,29.34 4.3,42.66 v5.63,44 | X11.6 101.13,48.6 100.93,48.2 102.03,44.1 98.23,41.4 84.73,41.4 83.03,39.7 83.03,28.6 82.63,28.2 | X3.3 85.09,2.54 | 85.09,2.54 84.53,3.1 80.53,3.1 v79.83,3.8 | 13.18,60.65 11.23,58.7 11.23,57.8 v10.73,57.3
  Bottom 0.203: X2.6 5.63,19.8 8.03,12.7 9.33,12.7 9.63,12.4 9.63,7.1 | 97.53,10 97.53,12.5 99.23,14.2 99.75,14.2 X15.6
  Bottom 0.229: v13.73,57.3 11.63,55.2 11.63,50 v5.63,44 | X4.3 89.97,67.26 92.23,65 92.23,63.7 91.03,62.5 71.33,62.5 65.93,57.1 65.93,41 66.33,40.6 77.73,40.6 77.78,40.65 78.23,40.2 78.23,26.6 77.43,25.8 77.43,25 78.23,24.2 78.63,24.2 83.33,19.5 83.33,11.9 84.13,11.1 v85.23,11.1 93.13,11.1 93.43,11.4 93.43,16.8 95.03,18.4 95.03,21.9 v96.23,23.1 | X15.6 | 97.53,10 93.43,5.9 v85.03,5.9 | v39.53,15.3 43.83,15.3 44.43,15.9 44.43,23.5 44.93,24 60.63,24 63.53,21.1 63.53,15.4 64.63,14.3 v64.63,13.4 | v79.83,3.8 77.93,5.7 71.23,5.7 v70.13,6.8 | X5.3 16.45,1.68 15.23,2.9 13.83,2.9 9.63,7.1 | X16.6 6.99,54.55 9.73,57.3 v10.73,57.3
LED_K0_OUT
  Top 0.229: X4.4 88.36,64.52 86.23,62.4 73.03,62.4 71.33,60.7 71.33,56.4 68.43,53.5 68.43,46.5 71.33,43.6 73.03,42 73.03,37.2 73.93,36.3 76.43,36.3 77.83,37.7 77.83,40.1 78.49,40.76 IC1.18
LED_K1_OUT
  Top 0.229: IC1.17 82.02,39.49 84.93,42.4 96.83,42.4 98.13,43.7 98.13,49.37 98.84,50.07 X11.5
LED_K2_OUT
  Top 0.203: 81.93,28.5 81.93,22.8 84.13,20.6 84.13,10.7 84.53,10.3
  Top 0.229: IC1.16 80.91,38.22 82.43,36.7 82.43,29 81.93,28.5 | 84.53,10.3 90.73,10.3 91.33,11.3 91.33,13.8 93.93,16.4 97.81,16.4 X15.5
LED_K3_OUT
  Top 0.203: 81.23,28.8 81.23,22.5 83.53,20.2 83.53,12.2 82.83,11.5
  Top 0.229: IC1.15 80.98,36.95 81.83,36.1 81.83,29.4 81.23,28.8 | 82.83,11.5 82.53,11.2 81.63,11.2 81.03,10.6 81.03,9.6 83.83,6.8 85.83,6.8 86.36,6.27 X3.4
LED_K4_OUT  (via drill 0.36)
  Top 0.229: IC1.14 80.65,35.68 81.23,35.1 81.23,29.6 80.53,28.9 80.53,21 79.33,19.8 79.33,11.8 78.83,11.3 v78.83,9.4 | v36.63,13.8 39.09,13.8 41.53,16.24 v41.53,17.7
  Bottom 0.229: v36.63,13.8 36.13,13.3 36.13,6.5 35.53,5.9 32.23,5.9 29.83,8.3 20.83,8.3 17.84,5.31 X5.4 | v41.53,17.7 41.93,18.1 41.93,25.7 42.43,26.2 56.73,26.2 57.03,25.9 61.73,25.9 66.13,21.5 66.13,16.5 68.03,14.6 68.03,11.1 69.73,9.4 v78.83,9.4
LED_K5_OUT  (via drill 0.36)
  Top 0.229: v25.33,21.1 25.23,21.2 25.23,26.4 22.93,28.7 18.63,28.7 17.23,27.3 12.13,27.3 8.23,23.4 8.23,20.5 X2.5 | IC1.13 74.62,34.41 v73.63,35.4
  Bottom 0.229: v25.33,21.1 25.33,19.7 27.83,17.2 37.33,17.2 38.13,18 38.13,22 39.33,23.2 39.33,28.3 40.53,29.5 57.23,29.5 58.23,28.5 60.33,28.5 61.03,29.2 61.03,29.8 61.33,30.1 66.43,30.1 67.13,30.8 71.73,30.8 73.03,29.5 73.83,29.5 74.68,30.34 74.68,34.36 v73.63,35.4
LED_K6_OUT  (via drill 0.36)
  Top 0.203: X16.5 14.41,52.38 14.6,52.57
  Top 0.229: IC1.12 78.67,33.14 77.23,31.7 74.73,31.7 v73.73,32.7 | 14.6,52.57 v17.33,55.3
  Bottom 0.203: 59.83,29.9 59.53,29.6 58.63,29.6 56.43,31.8 47.33,31.8 46.83,32.3 41.23,32.3 39.43,34.1 39.43,37.4
  Bottom 0.229: v17.33,55.3 23.53,55.3 25.33,53.5 34.33,53.5 39.43,48.4 39.43,37.4 | 59.83,29.9 59.83,30.9 60.73,31.8 73.03,31.8 73.73,32.5 v73.73,32.7
LED_K7_OUT  (via drill 0.36)
  Top 0.229: IC1.11 78.3,31.87 77.13,30.7 74.43,30.7 72.33,32.8 v72.33,37.3 | X8.4 18.65,67.68 19.93,66.4 v26.83,66.4
  Bottom 0.203: 37.43,59.4 28.53,59.4 27.13,60.8
  Bottom 0.229: 27.13,60.8 27.13,66.1 v26.83,66.4 | 37.43,59.4 45.73,59.4 46.33,60 46.33,61 47.43,62.1 49.33,62.1 50.43,61 50.43,58.5 51.63,57.3 51.63,49.8 50.43,48.6 50.43,47 50.83,46.6 50.83,44.5 58.33,37 72.03,37 v72.33,37.3
MOTOR_A_IN1
  Top 0.203: U2.21 35.77,33.83 36.93,35 43.53,35 49.83,41.3 U3.41
MOTOR_A_IN2
  Top 0.203: U2.22 34.42,34.5 35.63,34.5 36.73,35.6 43.23,35.6 49.03,41.4 U3.40
MOTOR_A_OUT1
  Top 0.305: U2.2 27.47,35.13 27.63,35.3 27.43,35.3 | 26.53,35.3 27.43,35.3 | 27.43,35.3 27.63,35.5 26.8,35.5 | 26.53,35.5 26.8,35.5 | 26.8,35.5 U2.1
  Top 0.508: X9.1 24.62,36.31 25.43,35.5 26.53,35.5
MOTOR_A_OUT2
  Top 0.305: U2.6 26.53,32.6 27.63,32.7 26.53,32.8 26.64,32.81 27.63,32.9 26.53,33 U2.5
  Top 0.508: X9.2 23.79,35.04 25.93,32.9 26.55,32.9 26.64,32.81
MOTOR_A_PWM
  Top 0.203: U2.23 35.47,35.13 36.53,36.2 43.03,36.2 48.23,41.4 U3.39
MOTOR_B_IN1
  Top 0.203: U2.17 35.6,31.24 36.33,30.5 37.73,30.5 38.43,29.8 38.43,26.3 39.73,25 43.53,25 44.53,26 44.53,33.1 47.73,36.3 47.73,38.2 50.63,41.1 U3.42
MOTOR_B_IN2
  Top 0.203: U2.16 35.45,30.58 36.13,29.9 37.43,29.9 37.73,29.6 37.73,26.2 39.43,24.5 43.83,24.5 45.03,25.7 45.03,32.6 48.53,36.1 48.53,38.1 51.43,41 U3.43
MOTOR_B_OUT1
  Top 0.305: U2.12 27.47,28.64 27.63,28.8 27.13,28.8 27.03,28.7 26.73,28.7 26.43,29 27.37,29 | 27.73,29 27.37,29 | 27.37,29 U2.11
  Top 0.508: X9.4 21.23,32.5 24.73,29 26.43,29
MOTOR_B_OUT2
  Top 0.305: U2.8 26.7,31.24 26.53,31.4 27.63,31.4 27.63,31.6 26.8,31.6 | 26.53,31.6 26.8,31.6 | 26.8,31.6 U2.7
  Top 0.508: X9.3 23.16,33.77 25.33,31.6 26.53,31.6
MOTOR_B_PWM  (via drill 0.36)
  Top 0.203: v30.63,29.4 30.23,29.8 30.23,33.9 32.23,35.9 32.43,35.9 33.03,36.5 35.33,36.5 35.53,36.7 42.73,36.7 47.43,41.4 U3.38 | v32.73,29.4 32.83,29.4 33.37,29.93 U2.15
  Bottom 0.203: v30.63,29.4 v32.73,29.4
MOTOR_STBY  (via drill 0.36)
  Top 0.203: U2.19 32.77,32.53 v32.73,32.5 | U3.22 39.33,52.2 36.33,55.2 34.03,55.2 31.83,53 31.43,52.6 30.93,52.6 v30.03,51.7
  Bottom 0.203: v32.73,32.5 31.83,32.5 27.83,36.5 27.43,36.5 25.93,38 25.93,47.1 30.03,51.2 v30.03,51.7
N$1
  Top 0.203: U$1.S 24.42,56.4 R1.1
N$2
  Top 0.203: U$2.S 23.12,59.74 R2.1
N$3
  Top 0.203: U$3.S 24.36,63.25 R3.1
N$4
  Top 0.203: U3.62 59.13,54.6 60.01,55.48 R5.2 62.45,55.48 63.2,54.73 R4.1
N$5
  Top 0.203: U$8.S 23.83,53.29 22.53,52 19.27,52 X10.9
N$6
  Top 0.203: IC3.13 60.8,26.04 62.43,24.4 63.43,24.4 IC2.3
N$7
  Top 0.203: IC3.12 60.45,25.39 62.63,23.2 63.4,23.2 IC2.4
N$8
  Top 0.203: R41.2 12.8,18.36 U$5.G
N$9
  Top 0.203: IC3.11 59.9,24.73 62.73,21.9 63.43,21.9 IC2.5
N$10
  Top 0.203: IC3.10 59.65,24.09 61.83,21.9 61.83,21.1 62.33,20.6 63.44,20.6 IC2.6
N$11
  Top 0.203: R23.1 67.95,66.37 U$22.LED_A
N$12
  Top 0.203: IC3.9 59.4,23.44 61.23,21.6 61.23,20.9 62.23,19.9 62.89,19.9 IC2.7
N$13
  Top 0.203: IC3.7 55.15,24.09 57.03,22.2 59.13,22.2 62.03,19.3 62.03,18.6 62.53,18.1 63.42,18.1 IC2.8
N$15  (via drill 0.36)
  Top 0.203: R10.1 75.83,22.2 v75.23,21.6 | v72.03,11 R9.2 | v80.03,19 IC5.4 82.73,19 82.93,18.8 82.93,12.5 82.23,11.8 80.63,11.8 v79.83,11
  Bottom 0.203: v75.23,21.6 75.23,21 76.13,20.1 78.93,20.1 v80.03,19 | v72.03,11 72.13,10.9 79.73,10.9 v79.83,11
N$16
  Top 0.203: S1.4 46.1,5.76 47.53,7.2 | 47.53,7.2 47.53,8.35 C13.1 47.48,8.65 46.13,10 46.13,10.15 R7.2 | S1.3 48.97,5.76 47.53,7.2
N$17
  Top 0.203: C14.1 R10.2
N$18  (via drill 0.36)
  Top 0.203: S1.1 S1.2 | v44.33,8.4 44.33,12.2 44.73,12.6 | 44.53,17.22 44.53,12.8 44.73,12.6 | 44.73,12.6 R8.2
  Top 0.229: 44.53,17.22 U$7.2
  Bottom 0.203: S1.2 42.98,2.15 45.63,4.8 45.63,7.1 v44.33,8.4
N$19
  Top 0.203: R42.1 16.06,18.73 LED11.C
N$20
  Top 0.203: R25.1 36.1,1.07 U$23.LED_A
N$21
  Top 0.203: IC1.1 70.59,40.7 67.93,40.7 67.41,40.17 IC4.15
N$22
  Top 0.203: 44.53,22.31 44.53,23.4 45.03,23.9 47.03,23.9 47.63,23.3 47.63,22.1 48.43,21.3 48.43,18.65 U$7.4 47.03,17.25 47.03,16.4 47.48,15.95 R6.2 48.68,14.7 49.53,13.85 49.53,11 49.03,10.5 R7.1
  Top 0.229: 46.98,17.2 U$7.4 | 44.53,22.31 U$7.7 U$7.8
N$23
  Top 0.203: U$21.LED_A 41.79,65.65 R21.1
N$24
  Top 0.203: IC4.14 70.61,39.52 IC1.2
N$26
  Top 0.203: 64.93,2.5 64.93,3.23 U$24.LED_A 64.77,2.77 R27.1
N$27
  Top 0.203: IC4.13 69.06,38.88 69.73,38.2 70.63,38.2 IC1.3
N$28
  Top 0.203: IC4.12 68.61,38.22 69.83,37 70.6,37 IC1.4
N$29
  Top 0.203: R30.2 49.82,66.43 LED9.A
N$30
  Top 0.203: IC4.11 68.16,37.57 69.13,36.6 69.13,36.2 69.63,35.7 70.63,35.7 IC1.5
N$31
  Top 0.203: IC4.10 67.91,36.92 68.43,36.4 68.43,35.4 69.43,34.4 70.64,34.4 IC1.6
N$32
  Top 0.203: R31.2 LED10.A
N$33
  Top 0.203: IC1.7 69.79,33.14 67.73,35.2 67.73,35.9 67.33,36.3 66.61,36.3 IC4.9
N$34
  Top 0.203: IC1.8 70.58,31.8 69.43,31.8 69.23,31.6 69.23,27.9 69.03,27.7 68.13,27.7 64.93,30.9 64.93,32.7 64.13,33.5 59.13,33.5 57.63,35 57.63,36.7 57.86,36.92 IC4.7
N$36  (via drill 0.36)
  Top 0.203: IC5.2 81.41,16.4 80.53,16.4 80.03,15.9 80.03,14.1 v80.43,13.7 | C15.1 74.28,12.4 74.43,12.4 v75.73,13.7
  Bottom 0.203: v75.73,13.7 v80.43,13.7
N$38
  Top 0.203: R35.2 27.52,62.04 U$3.G
N$39
  Top 0.203: R36.2 26.58,60.02 U$2.G
N$40
  Top 0.203: R37.2 28.18,58.01 U$1.G
PDI_CLK  (via drill 0.36)
  Top 0.203: v55.83,50.6 U3.57 | 57.23,50.63 U3.57 | v57.93,59 v57.93,62.2 | R34.2 60.4,49.23 59.03,50.6 U3.57
  Bottom 0.203: SV1.5 60.13,64.4 v57.93,62.2 | v55.83,50.6 55.03,51.4 55.03,55.8 57.93,58.7 v57.93,59
PDI_DATA  (via drill 0.36)
  Top 0.203: SV1.1 55.05,62.78 56.43,61.4 56.43,57.3 v54.13,55 | U3.56 v54.43,49.8
  Bottom 0.203: v54.43,49.8 54.13,49.8 53.63,50.3 53.63,54.5 v54.13,55
RGB_LED_MK0
  Top 0.203: U3.51 58.43,45.8 59.13,45.1 59.13,40.96 IC4.1
RGB_LED_MK1
  Top 0.203: IC4.2 58.16,40.17 57.73,40.6 57.73,41.5 58.63,42.4 58.63,44.5 58.13,45 U3.50
RGB_LED_MK2
  Top 0.203: IC4.3 58.92,39.6 57.83,39.6 57.03,40.4 57.03,44 U3.49
RPI_RX  (via drill 0.36)
  Top 0.203: U$26.GPIO_15 22.13,9.99 23.43,11.3 23.43,12.8 24.03,13.4 25.03,13.4 25.83,14.2 27.03,14.2 30.33,17.5 33.33,17.5 34.43,18.6 v34.43,20.3 | U3.29 40.23,46.6 38.63,48.2 37.33,48.2 36.53,49 32.33,49 v30.43,47.1
  Bottom 0.203: v34.43,20.3 34.43,22.3 34.73,22.6 34.73,37.2 32.33,39.6 31.03,39.6 29.23,41.4 29.23,45.9 v30.43,47.1
RPI_TX  (via drill 0.36)
  Top 0.203: U$26.GPIO_14 19.59,10.15 20.83,11.4 20.83,13.1 21.83,14.1 24.73,14.1 25.53,14.9 26.53,14.9 29.93,18.3 32.13,18.3 v33.23,19.4 | U3.28 40.43,47.4 39.03,48.8 37.63,48.8 36.73,49.7 31.93,49.7 v29.43,47.2
  Bottom 0.203: v33.23,19.4 33.23,22.1 34.03,22.9 34.03,36.6 31.63,39 30.33,39 28.43,40.9 28.43,46.2 v29.43,47.2
SCL
  Top 0.203: U$25.SCL 21.68,38.75 23.13,37.3 26.68,37.3 R32.2 35.27,37.24 35.23,37.2 42.33,37.2 46.63,41.5 U3.37
  Bottom 0.203: U$26.GPIO_1 17.05,12.99 14.13,15.9 14.13,21.7 13.23,22.6 13.23,33.6 14.53,34.9 17.13,34.9 17.93,35.7 17.93,36.65 U$25.SCL 15.78,38.7 14.03,38.7 8.66,33.33 JP1.3
SDA
  Top 0.203: U$25.SDA 14.43,36.2 13.53,37.1 13.53,39.1 14.53,40.1 23.23,40.1 25.19,42.06 R33.2 26.8,42.1 | 31.23,37.8 42.13,37.8 45.83,41.5 U3.36
  Top 0.229: 26.8,42.1 27.53,42.1 28.43,41.2 28.43,40.3 29.83,38.9 29.83,38.3 30.33,37.8 31.23,37.8
  Bottom 0.203: 12.33,34.1 12.43,34.2 | U$25.SDA 14.43,36.2 12.63,34.4 12.43,34.2 | U$26.GPIO_0 14.51,14.63 13.53,15.6 13.53,21.5 12.43,22.6 12.43,34.2
  Bottom 0.229: JP1.4 10.29,32.06 12.63,34.4
SPEAKER_O1
  Top 0.203: IC5.8 76.63,14.95 76.63,12.1 75.53,11 75.53,7.5 77.44,5.59 X1.1
SPEAKER_O2
  Top 0.203: 74.83,20.1 74.63,19.9 74.63,16 73.83,15.2 72.13,15.2 72.03,15.1 R9.1 71.98,14 69.43,14 69.03,13.6 69.03,11.7 69.83,10.9 70.63,10.9 76.17,5.36 X1.2
  Top 0.229: 74.83,20.1 76.39,20.1 IC5.5